# EAGLE design Min_Core_Display (EAGLE 9.2.2)
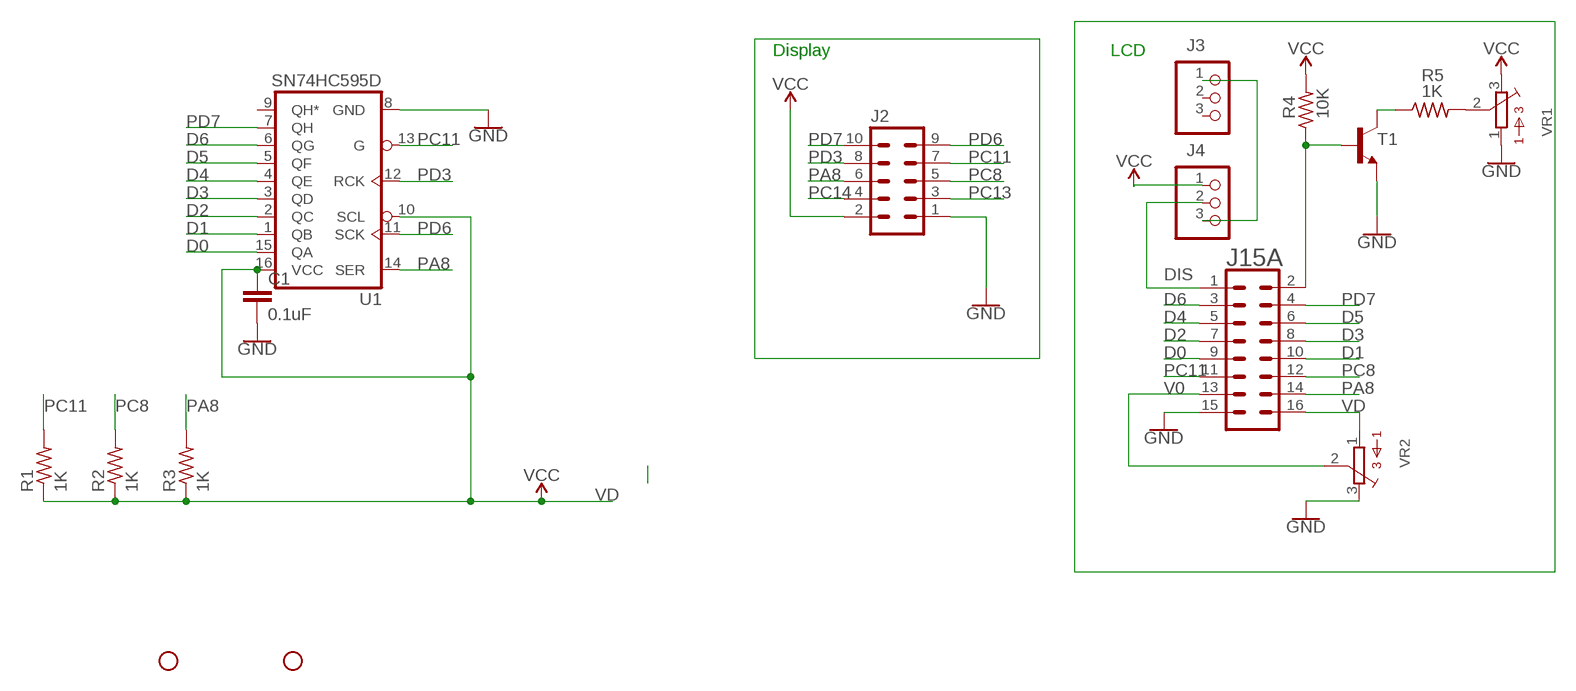
[diagram p0: schematic, sheet 1]

## Parts
C1  0.1uF  0.1UF-0603-25V-(+80/-20%)  [0603]
H2  STAND-OFFTIGHT  [STAND-OFF-TIGHT]
H4  STAND-OFFTIGHT  [STAND-OFF-TIGHT]
J2  10PIN_BACKSIDE  [10PIN_BACKSIDE]
J3  PINHD-1X3  [1X03]
J4  PINHD-1X3  [1X03]
J15A  CONN_08X2_SHROUD  [2X8-SHROUDED_LOCK]
R1  1K  R-US_R0603  [R0603]
R2  1K  R-US_R0603  [R0603]
R3  1K  R-US_R0603  [R0603]
R4  10K  R-US_R0603  [R0603]
R5  1K  R-US_R0603  [R0603]
T1  MMBT3904LT1-NPN-SOT23-BEC  [SOT23-BEC]
U1  SN74HC595D  74HC595D  [SO16]
VR1  BOURNS_3362P_TRIMMERP  [BOURNS_3362P_TRIMMER]
VR2  BOURNS_3362P_TRIMMERP  [BOURNS_3362P_TRIMMER]

## Nets
D0: J15A.9 U1.15(QA)
D1: J15A.10 U1.1(QB)
D2: J15A.7 U1.2(QC)
D3: J15A.8 U1.3(QD)
D4: J15A.5 U1.4(QE)
D5: J15A.6 U1.5(QF)
D6: J15A.3 U1.6(QG)
DIS: J4.2 J15A.1
GND: C1.2 J2.1 J15A.15 T1.E U1.8(GND) VR1.1 VR2.3
N$2: R5.1 T1.C
N$5: R5.2 VR1.2
N$7: J15A.2 R4.1 T1.B
N$9: J3.1 J4.3
PA8: J2.6 J15A.14 R3.2 U1.14(SER)
PC8: J2.5 J15A.12 R2.2
PC11: J2.7 J15A.11 R1.2 U1.13(G)
PC13: J2.3
PC14: J2.4
PD3: J2.8 U1.12(RCK)
PD6: J2.9 U1.11(SCK)
PD7: J2.10 J15A.4 U1.7(QH)
V0: J15A.13 VR2.2
VCC: J2.2 J4.1 R4.2 VR1.3
VD: C1.1 J15A.16 R1.1 R2.1 R3.1 U1.10(SCL) U1.16(VCC) VR2.1 ; supply symbol labelled VCC
Unconnected: J3.2 J3.3 U1.9(QH*)

## Notes on the sheet
- Display | LCD

## Library data of the parts
C1 = SparkFun-Capacitors:0.1UF: 0.1µF ceramic capacitors A capacitor is a passive two-terminal electrical component used to store electrical energy temporarily in an electric field.; PROD_ID: CAP-00810
H2 H4 = SparkFun-Hardware:STAND-OFF: Stand Off Drill holes for mechanically mounting via screws, standoffs, etc. Note: Use the keepout ring to avoid running the screw head into surrounding components. Variant Overviews STAND-OFF - Mechanical footprint for a #4 phillips button head screw. STAND-OFF-TIGHT - Mechanical footprint for a #4 phillips button head screw, Example SparkFun Products Screw - Phillips Head (1/4", 4-40, 10 pack) <https://www.sparkfun.com/products/10453> (PRT-10453) Screw - Phillips Head (1/2", 4-40, 10 pack) <https://www.sparkfun.com/products/10452> (PRT-10452) Screw - Phillips Head (3/4", 4-40, 10 pack) <https://www.sparkfun.com/products/10451> (PRT-10451) Screw - Phillips Head (1", 4-40, 10 pack) <https://www.sparkfun.com/products/10450> (PRT-10450)
J2 = MusicThingModular:10PIN_BACKSIDE: PIN HEADER; OC_FARNELL: unknown; OC_NEWARK: unknown
J3 J4 = adafruit:PINHD-1X3: PIN HEADER
J15A = SparkFun-Connectors:CONN_08X2: Multi connection point. Often used as Generic Header-pin footprint for 0.1 inch spaced/style header connections You can populate with any combo of single row headers, but if you'd like an exact match, check this: Header - 2x8 (Male, 0.1") <https://www.sparkfun.com/products/13156> (PRT-13156) On any of the 0.1 inch spaced packages, you can populate with these: Break Away Headers - Straight <https://www.sparkfun.com/products/116> (PRT-00116) Break Away Male Headers - Right Angle <https://www.sparkfun.com/products/553> (PRT-00553) Female Headers <https://www.sparkfun.com/products/115> (PRT-00115) Break Away Headers - Machine Pin <https://www.sparkfun.com/products/117> (PRT-00117) Break Away Female Headers - Swiss Machine Pin <https://www.sparkfun.com/products/743> (PRT-00743)
R1-R5 = adafruit:R-US_: RESISTOR, American symbol
T1 = MusicThingModular:*-NPN-: NPN Transistror BF959 corrected 2008.03.06
U1 = SparkFun-IC-Logic:74*595: 8-Bit Shift Register (Serial to Parallel) Datasheet <http://cdn.sparkfun.com/datasheets/BreakoutBoards/MM74HC595.pdf> SparkFun Products SparkFun Shift Register Breakout - 74HC595 <https://www.sparkfun.com/products/10680> (BOB-10680); PROD_ID: IC-07875
VR1 VR2 = MusicThingModular:BOURNS_3362P_TRIMMER: 3362 Series 1/4" Square Trimmer

## Net classes
0 default: width 0.508 mm, drill 1.016 mm, clearance 0.508 mm

## Board
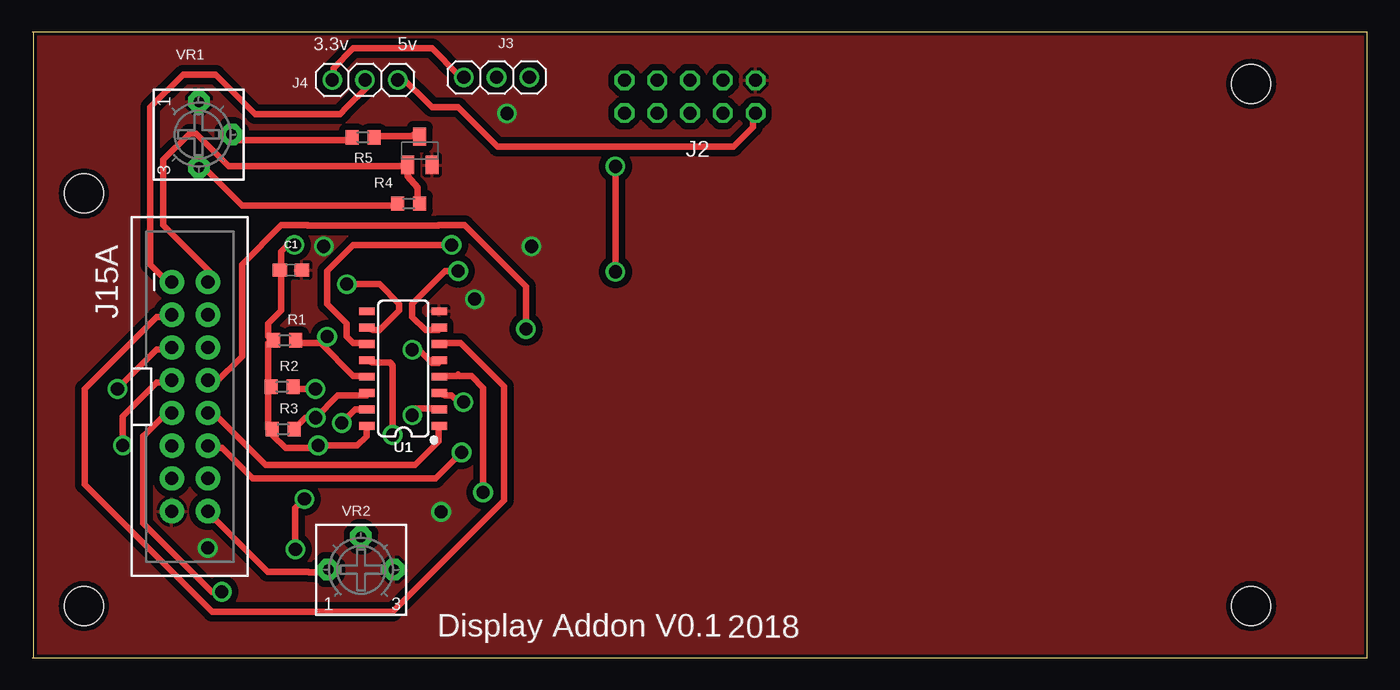
[diagram p1: board, top side]
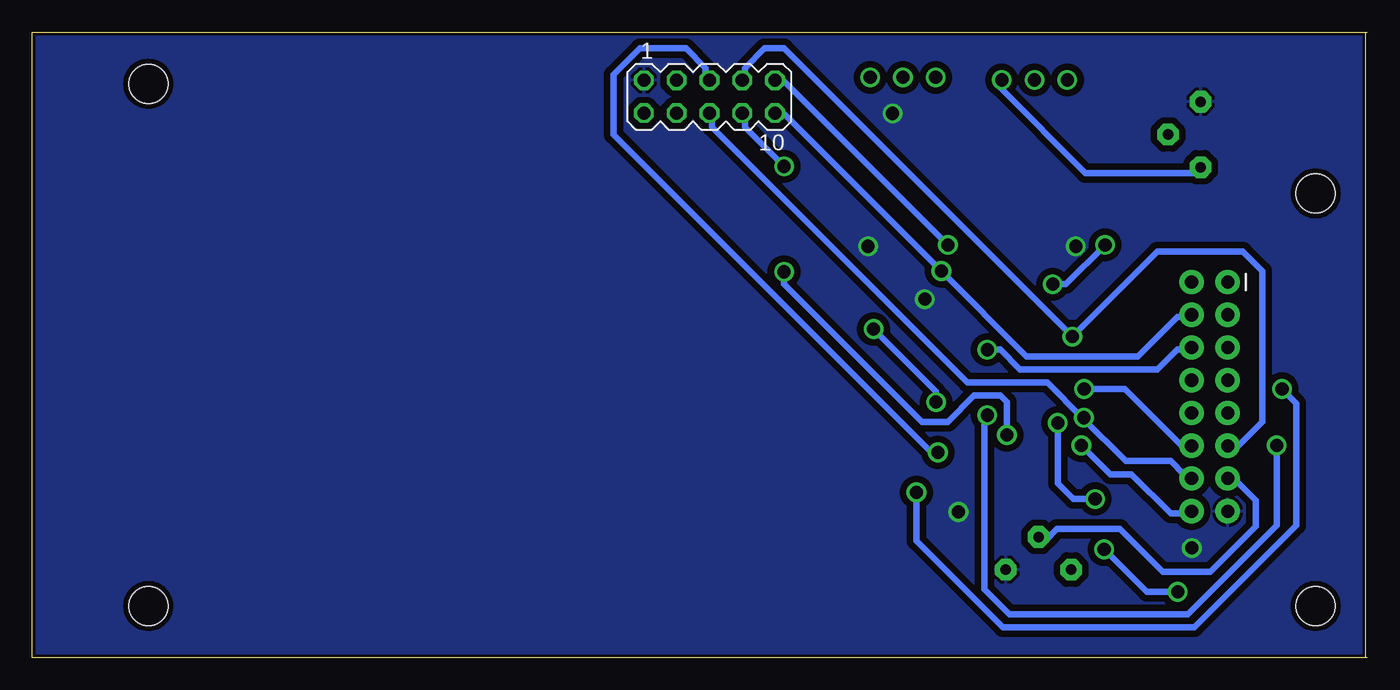
[diagram p2: board, bottom side, seen from below]

Size 103.5 x 48.5 mm. Coordinates in mm from the lower left corner, seen from the top.
Outline: 0,0 0.1,0
Outline: 0.1,0 103.5,0 103.5,48.5 0.1,48.5
Outline: 0.1,48.5 0,48.5
Outline: 0.1,0 0.1,48.5
Copper layers (1*16): Top 0.035mm / dielectric 1.5mm / Bottom 0.035mm
Design rules "dirt_cheap_dirty_boards.v1.1": minimum track width 6mil, minimum drill 12mil, track to track 6mil, track to pad 6mil, pad to pad 6mil, via to via 6mil, smd to smd 0mil, copper to edge 10mil, drill to drill 10mil, minimum pad ring 10mil, minimum via ring 6mil, stop-mask expansion 2mil, vias tented up to drill 25mil, thermal gap 10mil

### Footprints (pad centres in the part's own frame; a part is rotated, then mirrored left to right if it is on the bottom)
0603 = smd 1.1 x 1: 1 -0.85,0; 2 0.85,0
STAND-OFF-TIGHT = hole 3.048: 0,0
10PIN_BACKSIDE = drill 1.016 octagon: 1 -5.08,-1.27; 2 -5.08,1.27; 3 -2.54,-1.27; 4 -2.54,1.27; 5 0,-1.27; 6 0,1.27; 7 2.54,-1.27; 8 2.54,1.27; 9 5.08,-1.27; 10 5.08,1.27
1X03 = drill 1.016: 1 -2.54,0; 2 0,0; 3 2.54,0
2X8-SHROUDED_LOCK = drill 1.016 pad 1.88: 1 -1.397,8.89; 2 1.397,8.89; 3 -1.397,6.35; 4 1.397,6.35; 5 -1.397,3.81; 6 1.397,3.81; 7 -1.397,1.27; 8 1.397,1.27; 9 -1.397,-1.27; 10 1.397,-1.27; 11 -1.397,-3.81; 12 1.397,-3.81; 13 -1.397,-6.35; 14 1.397,-6.35; 15 -1.397,-8.89; 16 1.397,-8.89
R0603 = smd 1 x 1.1: 1 -0.85,0; 2 0.85,0
SOT23-BEC = smd 1 x 1.4: B -0.95,-1.1; C 0,1.1; E 0.95,-1.1
SO16 = smd 0.6 x 1.2: 1 -4.445,-2.8; 2 -3.175,-2.8; 3 -1.905,-2.8; 4 -0.635,-2.8; 5 0.635,-2.8; 6 1.905,-2.8; 7 3.175,-2.8; 8 4.445,-2.8; 9 4.445,2.8; 10 3.175,2.8; 11 1.905,2.8; 12 0.635,2.8; 13 -0.635,2.8; 14 -1.905,2.8; 15 -3.175,2.8; 16 -4.445,2.8
BOURNS_3362P_TRIMMER = drill 0.813 pad 1.676 octagon: 1 -2.54,0; 2 0,2.54; 3 2.54,0

### Placement (x,y rotation side)
C1  20.05,30.06 0 top
H1  STAND-OFFTIGHT  [STAND-OFF-TIGHT]  94.5,4 0 top
H2  4,36 0 top
H3  STAND-OFFTIGHT  [STAND-OFF-TIGHT]  94.5,44.5 90 top
H4  4,4 0 top
J2  51,43.5 180 top
J3  36,45 0 top
J4  25.8,44.8 180 top
J15A  12.22,20.24 0 top
R1  19.58,24.61 0 top
R2  19.37,21.01 0 top
R3  19.46,17.71 0 top
R4  29.19,35.21 180 top
R5  25.64,40.34 180 top
T1  30.04,39.31 0 top
U1  28.76,22.42 90 top
VR1  12.91,40.57 270 top
VR2  25.49,6.82 0 top

### Tracks (layer width: path | path; a pad name or v marks a point on that pad's centre or on a via)
D0  (via drill 1.02)
  Top 0.508: J15A.9 10.42,18.97 8.65,17.2 8.6,17.2 8.6,10.42 13.92,5.1 v14.7,5.1 | v21.1,12.3 20.4,11.6 v20.4,8.4 | U1.15 25.05,19.25 v24,18.2
  Bottom 0.508: v21.1,12.3 22.8,12.3 24,13.5 v24,18.2 | v20.4,8.4 17.1,5.1 v14.7,5.1
D1
  Top 0.508: U1.1 31.5,17.78 31.5,16.76 29.66,14.93 18.09,14.93 13.72,19.3 J15A.10
D2  (via drill 1.02)
  Top 0.508: v29.46,18.8 29.46,19.3 31.5,19.3 U1.2 | v7.02,16.46 7.02,18.7 9.65,21.34 10.67,21.34 J15A.7
  Bottom 0.508: v29.46,18.8 29.66,18.6 29.66,5.28 27.75,3.36 13.91,3.36 7.02,10.25 v7.02,16.46
D3  (via drill 1.02)
  Top 0.508: v33.43,19.81 33.02,19.81 32.51,20.32 32,20.32 U1.3 | v38.28,25.48 38.28,28.78 33.53,33.53 31.5,33.53 31.49,33.52 21.34,33.52 21.34,33.53 19.3,33.53 16.26,30.48 16.26,23.37 14.22,21.34 13.72,21.34 J15A.8
  Bottom 0.508: v33.43,19.81 33.43,20.64 v38.28,25.48
D4  (via drill 1.02)
  Top 0.508: v34.95,12.81 34.95,20.93 34.04,21.84 33.14,21.84 33.02,21.95 32.91,21.84 32,21.84 U1.4 | v6.6,20.83 9.65,23.88 10.67,23.88 J15A.5
  Bottom 0.508: v34.95,12.81 34.95,9.04 28.26,2.35 13.4,2.35 5.5,10.25 5.5,19.72 v6.6,20.83
D5  (via drill 1.02)
  Top 0.508: v29.46,23.88 29.97,23.88 30.99,22.86 31.5,22.86 U1.5
  Bottom 0.508: v29.46,23.88 28.45,23.88 26.92,22.35 16.26,22.35 14.73,23.88 13.72,23.88 J15A.6
D6
  Top 0.508: U1.6 32,24.38 33.21,24.38 33.22,24.39 36.58,21.04 36.58,12.19 27.95,3.56 13.93,3.56 4.08,13.42 4.08,20.84 9.65,26.42 10.67,26.42 J15A.3
DIS
  Top 0.508: J4.2 25.91,44.7 25.91,44.2 24.38,42.67 23.87,42.16 17.27,42.16 14.22,45.21 11.68,45.21 9.14,42.67 9.14,30.48 10.16,29.46 10.16,28.96 10.67,28.96 J15A.1
GND  (via drill 1.02)
  other vias: 36.8,42.2 22.6,31.9 34.3,27.8 38.7,31.9 31.7,11.3 13.6,8.5
  pour Top: -4,52 106,52 106,-2 -4,-2
  pour Bottom: -2,52 106,52 106,-4 -2,-4
N$2
  Top 0.508: R5.1 26.58,40.43 29.46,40.43 29.68,40.65 T1.C
N$5
  Top 0.508: R5.2 24.38,40.13 15.75,40.13 VR1.2
N$7
  Top 0.508: R4.1 29.88,35.37 29.88,36.45 29.09,37.34 T1.B 28.68,38.1 15.24,38.1 12.7,40.64 12.19,40.64 10.16,38.61 10.16,33.53 14.22,29.46 14.22,28.96 13.72,28.96 J15A.2
N$9
  Top 0.508: J4.3 23.37,45.21 23.37,45.72 24.89,47.24 30.99,47.24 33.02,45.21 J3.1
PA8  (via drill 1.02)
  Top 0.508: R3.2 20.32,17.78 20.35,17.78 21.18,18.6 v21.98,18.6 23.69,20.32 25.91,20.32 U1.14
  Bottom 0.508: 22.07,18.6 18.7,15.24 15.24,15.24 14.22,14.22 14.22,13.72 13.72,13.72 J15A.14 | 22.07,18.6 24.8,21.34 30.99,21.34 50.8,41.15 50.8,42.16 J2.6 | 22.07,18.6 v21.98,18.6
PC8  (via drill 1.02)
  Top 0.508: v21.95,20.83 20.32,20.83 R2.2 | v33.29,15.91 31.29,13.91 17.08,13.91 14.73,16.26 13.72,16.26 J15A.12
  Bottom 0.508: v21.95,20.83 18.8,20.83 14.22,16.26 13.72,16.26 J15A.12 | v33.29,15.91 33.79,15.91 58.42,40.54 58.42,45.21 56.39,47.24 52.83,47.24 51.31,45.72 51.31,45.21 J2.5
PC11  (via drill 1.02)
  Top 0.508: 22.35,24.38 20.83,24.38 R1.2 | 22.35,24.38 24.89,21.84 25.91,21.84 U1.13 | 22.35,24.38 v22.86,24.89
  Bottom 0.508: J2.7 48.26,45.21 48.26,45.72 46.74,47.24 45.21,47.24 v22.86,24.89 16.26,31.5 9.65,31.5 8.13,29.97 8.13,18.29 10.16,16.26 10.67,16.26 J15A.11
PD3  (via drill 1.02)
  Top 0.508: v27.94,17.27 27.94,22.66 27.73,22.87 26.4,22.87 U1.12 | v45.21,38.1 v45.21,29.92
  Bottom 0.508: v27.94,17.27 27.94,19.81 28.45,20.32 30.48,20.32 32.51,18.29 34.54,18.29 45.21,28.96 v45.21,29.92 | v45.21,38.1 48.26,41.15 48.26,42.16 J2.8
PD6  (via drill 1.02)
  Top 0.508: v32.51,32 24.89,32 22.86,29.97 22.86,27.43 24.38,25.91 24.38,24.89 24.89,24.38 25.91,24.38 U1.11
  Bottom 0.508: v32.51,32 45.72,45.21 J2.9
PD7  (via drill 1.02)
  Top 0.508: v33.02,29.97 32,29.97 29.46,27.43 29.46,26.42 30.48,25.4 31.5,25.4 U1.7
  Bottom 0.508: J2.10 45.72,42.67 v33.02,29.97 26.42,23.37 17.78,23.37 14.73,26.42 13.72,26.42 J15A.4
V0
  Bottom 0.508: VR2.2 25.4,9.14 24.89,9.14 24.07,9.97 19.16,9.97 15.83,6.64 12.16,6.64 8.64,10.16 8.64,12.19 10.67,14.22 J15A.13
VCC
  Top 0.508: R4.2 28.05,35.05 16.26,35.05 13.21,38.1 VR1.3 | J2.2 55.88,42.16 55.88,41.15 54.36,39.62 36.07,39.62 33.02,42.67 30.99,42.67 28.45,45.21 J4.1
  Bottom 0.508: J4.1 28.45,44.7 28.45,44.2 21.84,37.59 13.21,37.59 VR1.3
VD  (via drill 1.02)
  Top 0.508: VR2.1 22.86,6.6 21.45,6.6 21.4,6.65 18.24,6.65 14.22,10.67 13.72,10.67 13.21,11.18 J15A.16 | U1.16 25.91,17.78 25.91,17.16 25.19,16.45 25.18,16.46 v22.16,16.46 22.3,16.32 22.3,16.25 19.64,16.25 18.65,17.24 18.65,17.67 R3.1 18.29,17.78 18.29,20.83 R2.1 18.29,21.34 18.29,24.38 R1.1 18.29,24.89 18.29,25.91 19.3,26.92 19.3,29.97 C1.1 19.3,30.48 19.3,31.5 19.81,32 v20.32,32 | v24.38,28.96 26.92,28.96 28.45,27.43 28.45,26.92 26.92,25.4 26.42,25.4 U1.10
  Bottom 0.508: v24.38,28.96 23.37,28.96 v20.32,32 | v22.16,16.46 19.93,14.22 18.29,14.22 15.24,11.18 13.72,11.18 J15A.16

### Text on the board
tPlace: 3.3v | 5v | J15A | Display Addon V0.1 | 2018